# EAGLE design Intan Headstage (EAGLE 9.6.2)
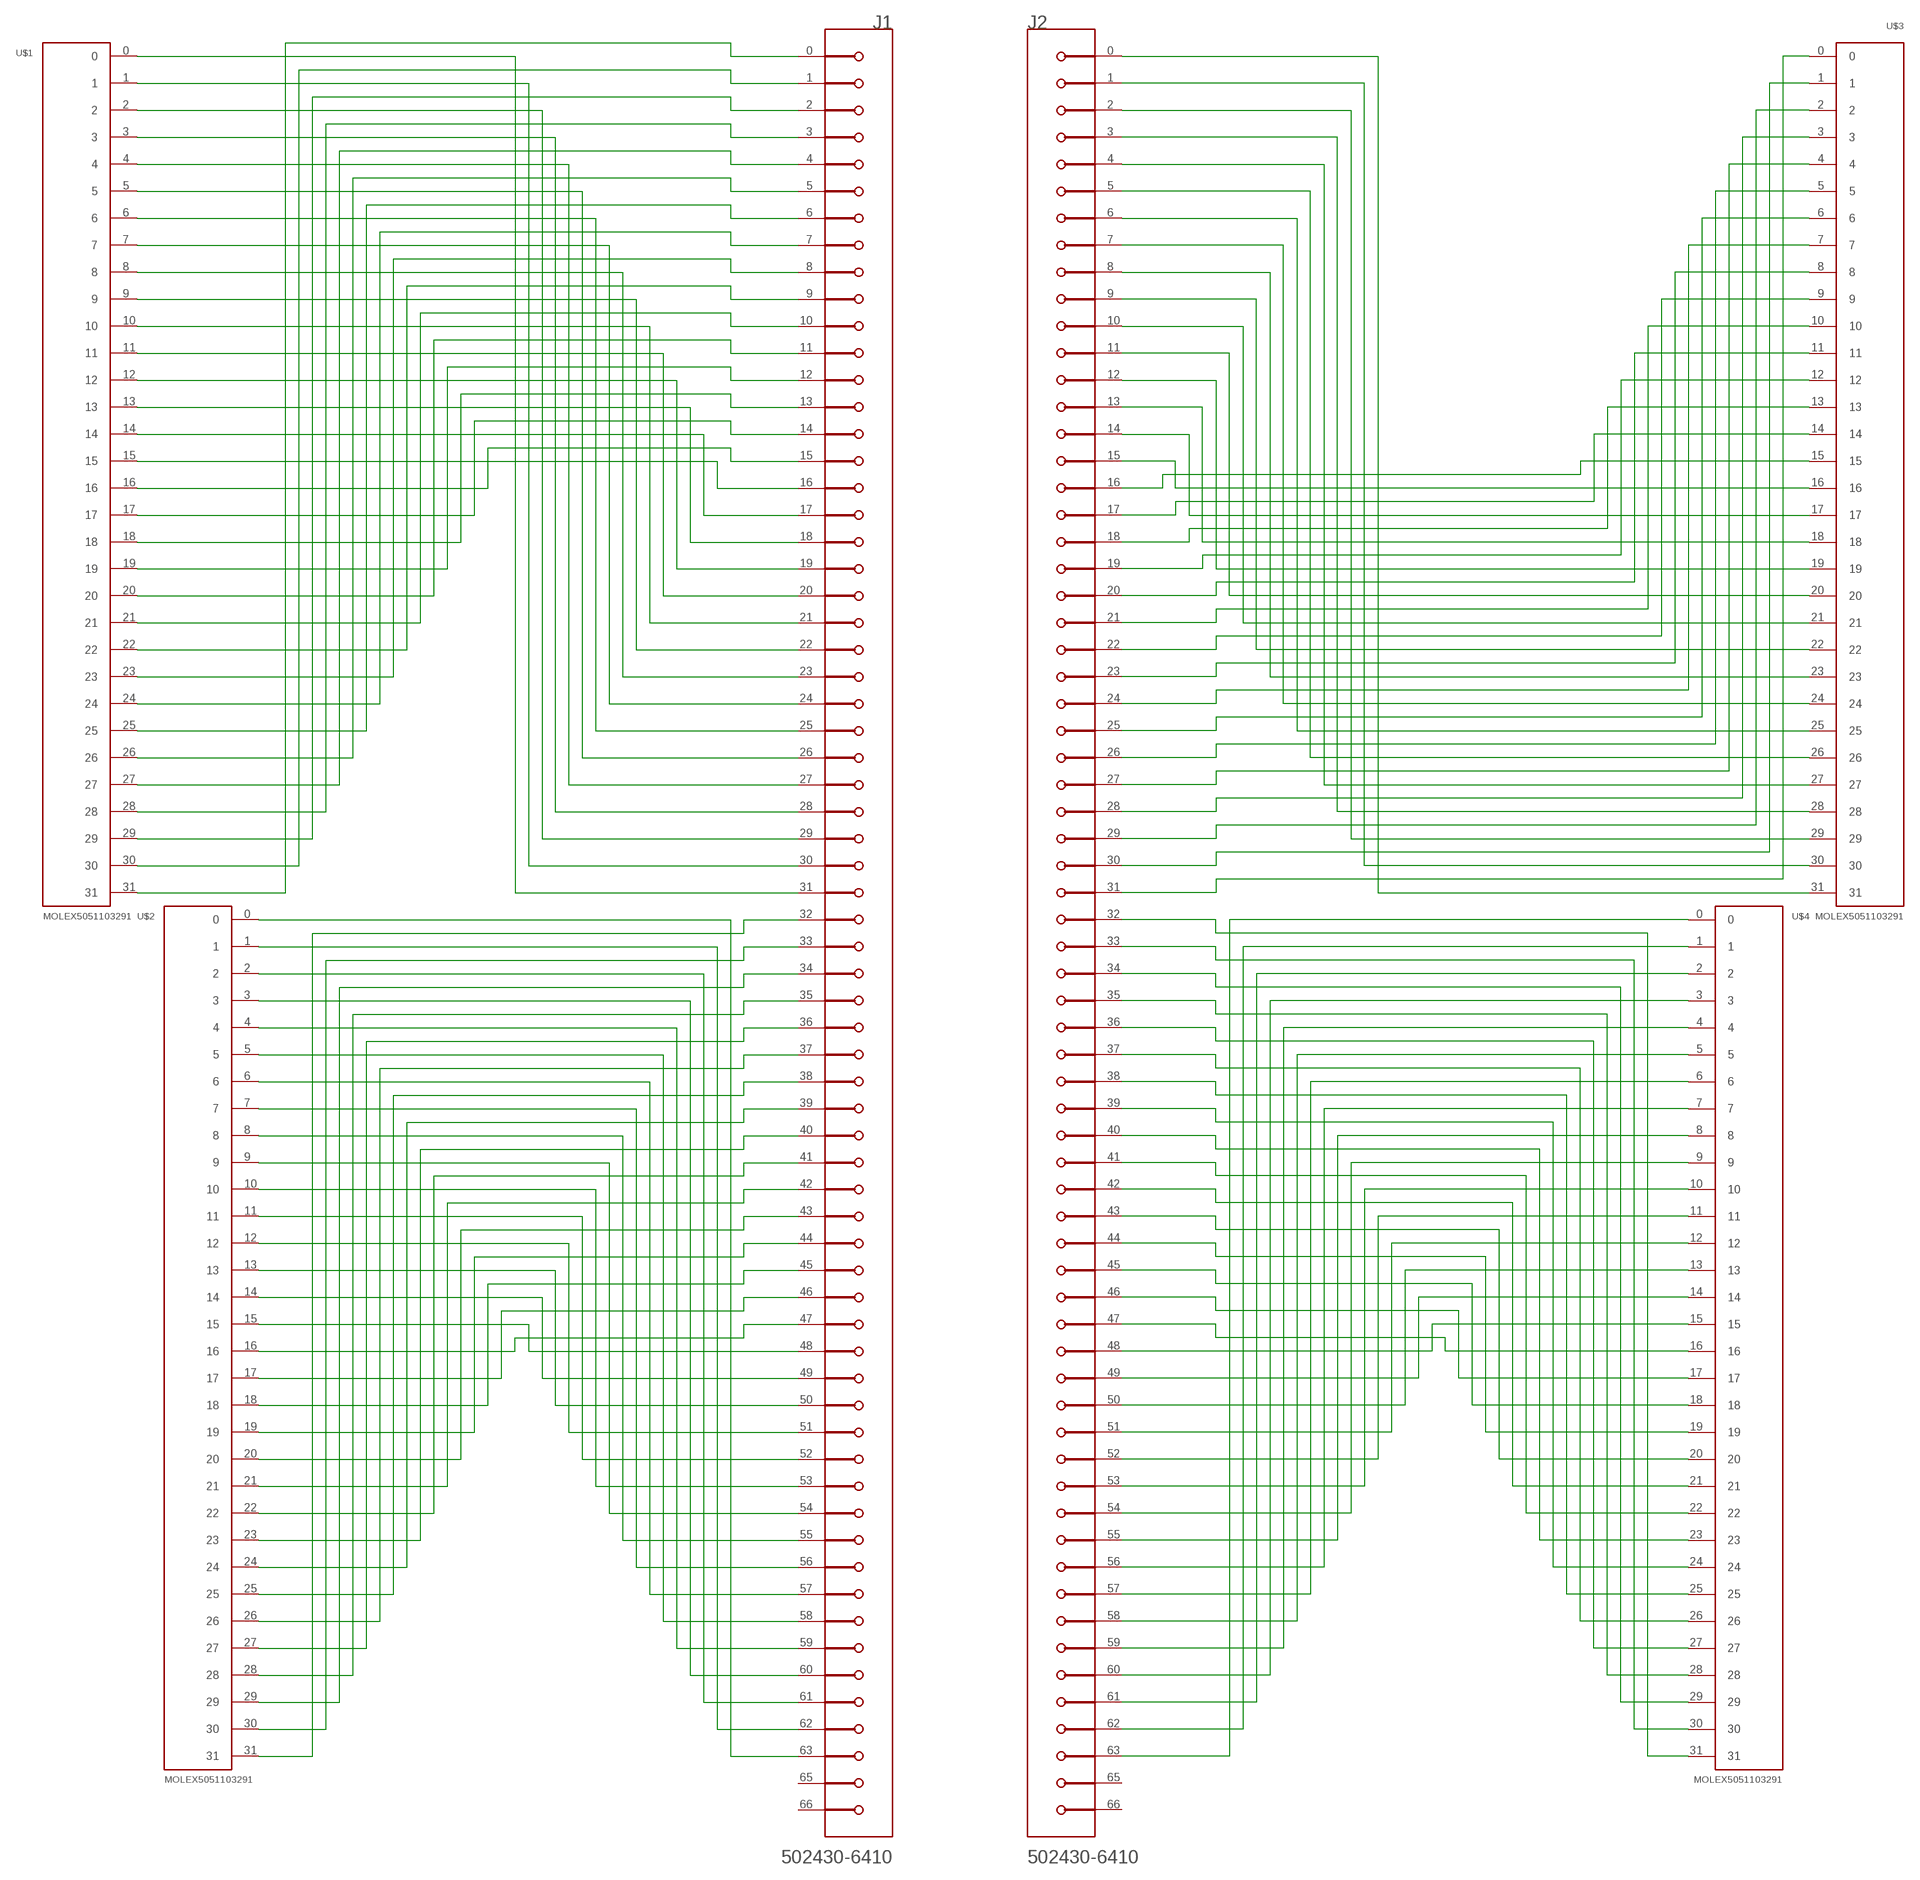
[diagram p0: schematic, sheet 1]

## Parts
J1  MOLEX_502430-6410MOLEX_502430-6410_0_0  [MOLEX_502430-6410_0]
J2  MOLEX_502430-6410MOLEX_502430-6410_0_0  [MOLEX_502430-6410_0]
U$1  MOLEX5051103291  [MOLEX5051103291]
U$2  MOLEX5051103291  [MOLEX5051103291]
U$3  MOLEX5051103291  [MOLEX5051103291]
U$4  MOLEX5051103291  [MOLEX5051103291]

## Nets
N$1: J1.31 U$1.0
N$2: J1.30 U$1.1
N$3: J1.29 U$1.2
N$4: J1.28 U$1.3
N$5: J1.27 U$1.4
N$6: J1.26 U$1.5
N$7: J1.25 U$1.6
N$8: J1.24 U$1.7
N$9: J1.23 U$1.8
N$10: J1.22 U$1.9
N$11: J1.21 U$1.10
N$12: J1.20 U$1.11
N$13: J1.19 U$1.12
N$14: J1.18 U$1.13
N$15: J1.17 U$1.14
N$16: J1.16 U$1.15
N$17: J1.15 U$1.16
N$18: J1.14 U$1.17
N$19: J1.13 U$1.18
N$20: J1.12 U$1.19
N$21: J1.11 U$1.20
N$22: J1.10 U$1.21
N$23: J1.9 U$1.22
N$24: J1.8 U$1.23
N$25: J1.7 U$1.24
N$26: J1.6 U$1.25
N$27: J1.5 U$1.26
N$28: J1.4 U$1.27
N$29: J1.3 U$1.28
N$30: J1.2 U$1.29
N$31: J1.1 U$1.30
N$32: J1.0 U$1.31
N$33: J2.0 U$3.31
N$34: J2.1 U$3.30
N$35: J2.2 U$3.29
N$36: J2.3 U$3.28
N$37: J2.4 U$3.27
N$38: J2.5 U$3.26
N$39: J2.6 U$3.25
N$40: J2.7 U$3.24
N$41: J2.8 U$3.23
N$42: J2.9 U$3.22
N$43: J2.10 U$3.21
N$44: J2.11 U$3.20
N$45: J2.12 U$3.19
N$46: J2.13 U$3.18
N$47: J2.14 U$3.17
N$48: J2.15 U$3.16
N$49: J2.31 U$3.0
N$50: J2.30 U$3.1
N$51: J2.29 U$3.2
N$52: J2.28 U$3.3
N$53: J2.27 U$3.4
N$54: J2.26 U$3.5
N$55: J2.25 U$3.6
N$56: J2.24 U$3.7
N$57: J2.23 U$3.8
N$58: J2.22 U$3.9
N$59: J2.21 U$3.10
N$60: J2.20 U$3.11
N$61: J2.19 U$3.12
N$62: J2.18 U$3.13
N$63: J2.17 U$3.14
N$64: J2.16 U$3.15
N$65: J1.63 U$2.0
N$66: J1.62 U$2.1
N$67: J1.61 U$2.2
N$68: J1.60 U$2.3
N$69: J1.59 U$2.4
N$70: J1.58 U$2.5
N$71: J1.57 U$2.6
N$72: J1.56 U$2.7
N$73: J1.55 U$2.8
N$74: J1.54 U$2.9
N$75: J1.53 U$2.10
N$76: J1.52 U$2.11
N$77: J1.51 U$2.12
N$78: J1.50 U$2.13
N$79: J1.49 U$2.14
N$80: J1.48 U$2.15
N$81: J1.47 U$2.16
N$82: J1.46 U$2.17
N$83: J1.45 U$2.18
N$84: J1.44 U$2.19
N$85: J1.43 U$2.20
N$86: J1.42 U$2.21
N$87: J1.41 U$2.22
N$88: J1.40 U$2.23
N$89: J1.39 U$2.24
N$90: J1.38 U$2.25
N$91: J1.37 U$2.26
N$92: J1.36 U$2.27
N$93: J1.35 U$2.28
N$94: J1.34 U$2.29
N$95: J1.33 U$2.30
N$96: J1.32 U$2.31
N$97: J2.32 U$4.31
N$98: J2.33 U$4.30
N$99: J2.34 U$4.29
N$100: J2.35 U$4.28
N$101: J2.36 U$4.27
N$102: J2.37 U$4.26
N$103: J2.38 U$4.25
N$104: J2.39 U$4.24
N$105: J2.40 U$4.23
N$106: J2.41 U$4.22
N$107: J2.42 U$4.21
N$108: J2.43 U$4.20
N$109: J2.44 U$4.19
N$110: J2.45 U$4.18
N$111: J2.46 U$4.17
N$112: J2.47 U$4.16
N$113: J2.48 U$4.15
N$114: J2.49 U$4.14
N$115: J2.50 U$4.13
N$116: J2.51 U$4.12
N$117: J2.52 U$4.11
N$118: J2.53 U$4.10
N$119: J2.54 U$4.9
N$120: J2.55 U$4.8
N$121: J2.56 U$4.7
N$122: J2.57 U$4.6
N$123: J2.58 U$4.5
N$124: J2.59 U$4.4
N$125: J2.60 U$4.3
N$126: J2.61 U$4.2
N$127: J2.62 U$4.1
N$128: J2.63 U$4.0
Unconnected: J1.65(MNT_1) J1.66(MNT_2) J2.65(MNT_1) J2.66(MNT_2)

## Library data of the parts
J1 J2 = Molex Slimstack:MOLEX_502430-6410: 64 Position Connector Plug, Outer Shroud Contacts Surface Mount Gold; CENTROID_NOT_SPECIFIED: No; DATASHEET: http://www.molex.com/pdm_docs/sd/5024306410_sd.pdf; DIGIKEY_DESCRIPTION: CONN PLUG 64POS VERT DUAL SMD; DIGIKEY_PART_NUMBER: WM24084TR-ND; IS_FEMALE: yes; LEAD_FREE: yes; MF: Molex; MOUSER_PART_NUMBER: 538-502430-6410; MPN: 502430-6410; PACKAGE: CONN_SMD; PREFIX: J; ROHS: yes; TEMPERATURE_RANGE_HIGH: +85°C; TEMPERATURE_RANGE_LOW: -20°C; VOLTAGE: 50V
U$1-U$4 = ZIF Connector:MOLEX5051103291

## Board
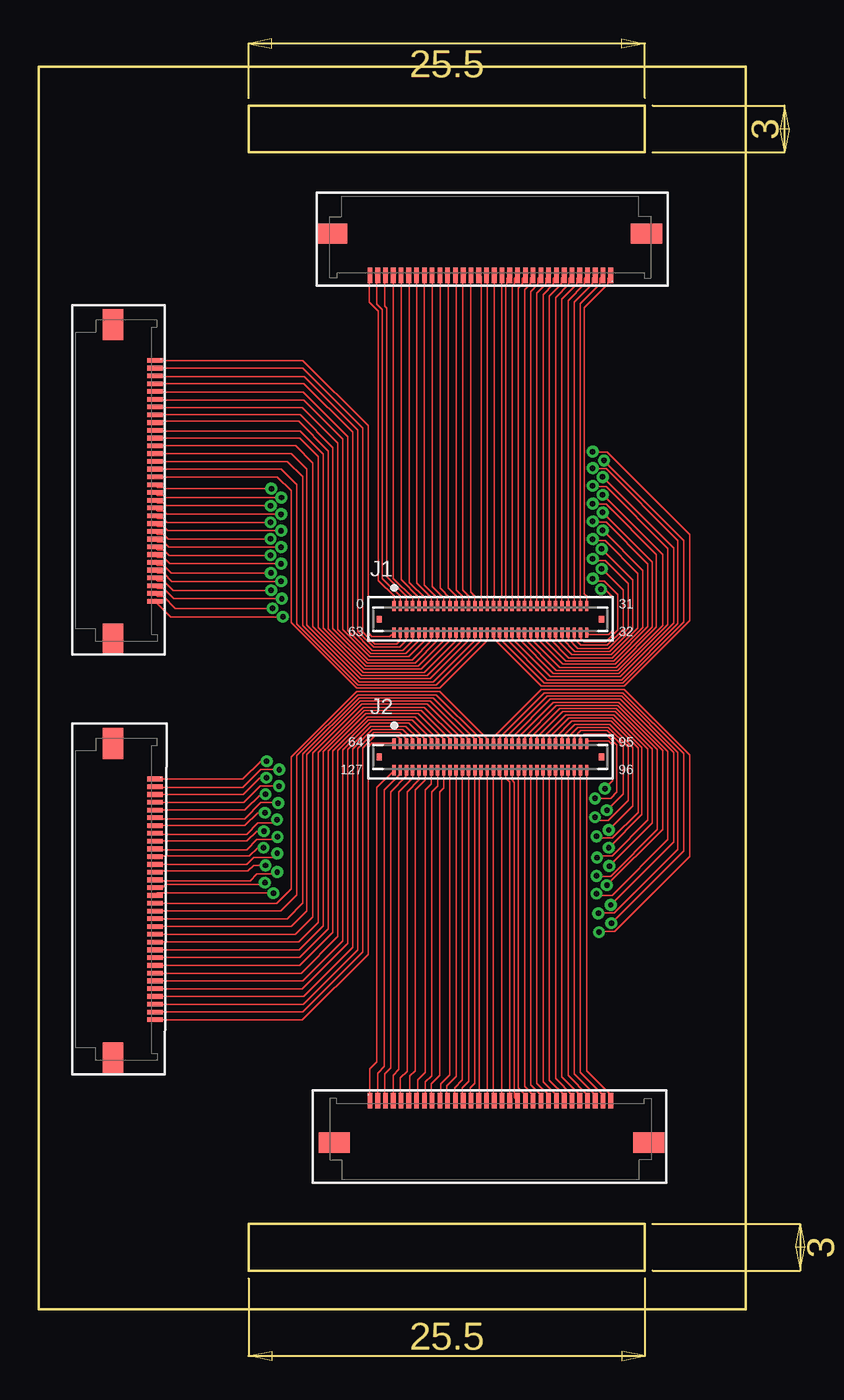
[diagram p1: board, top side]
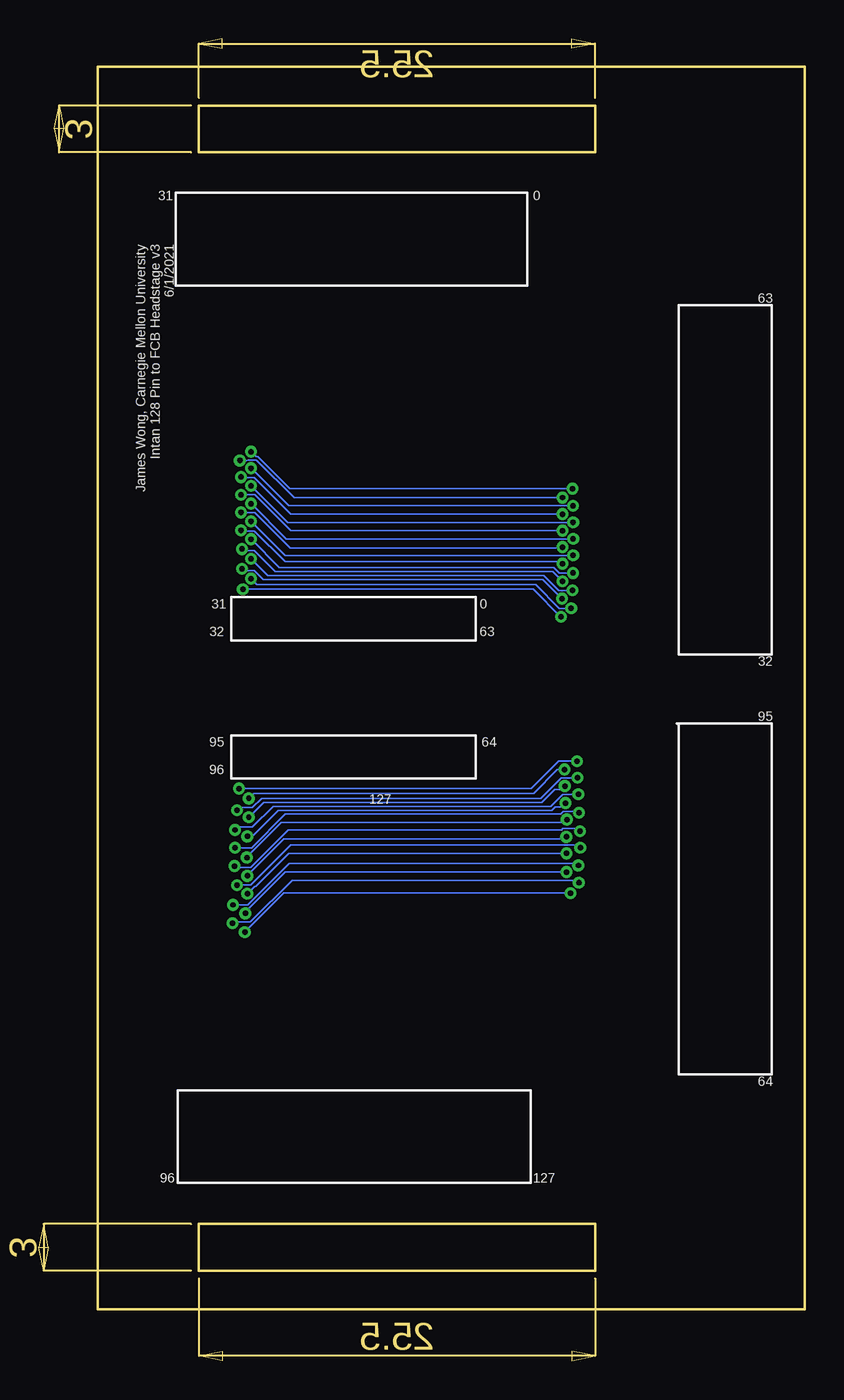
[diagram p2: board, bottom side, seen from below]

Size 45.5 x 80 mm. Coordinates in mm from the lower left corner, seen from the top.
Outline: 13.5,2.5 39,2.5 39,5.5 13.5,5.5 13.5,2.5
Outline: 39,77.5 13.5,77.5 13.5,74.5 39,74.5 39,77.5
Outline: 0,0 0,80 45.5,80 45.5,0 0,0
Copper layers (1*16): Top 0.035mm / dielectric 1.5mm / Bottom 0.035mm
Design rules "default *": minimum track width 4mil, minimum drill 0.35mm, track to track 4mil, track to pad 4mil, pad to pad 4mil, via to via 4mil, smd to smd 4mil, copper to edge 40mil, drill to drill 6mil, minimum pad ring 10mil, minimum via ring 8mil, stop-mask expansion 4mil, vias tented up to drill 0mil, thermal gap 10mil

### Footprints (pad centres in the part's own frame; a part is rotated, then mirrored left to right if it is on the bottom)
MOLEX_502430-6410_0 = smd 0.22 x 0.66: 0 -6.2,0.855; 1 -5.8,0.855; 2 -5.4,0.855; 3 -5,0.855; 4 -4.6,0.855; 5 -4.2,0.855; 6 -3.8,0.855; 7 -3.4,0.855; 8 -3,0.855; 9 -2.6,0.855; 10 -2.2,0.855; 11 -1.8,0.855; 12 -1.4,0.855; 13 -1,0.855; 14 -0.6,0.855; 15 -0.2,0.855; 16 0.2,0.855; 17 0.6,0.855; 18 1,0.855; 19 1.4,0.855; 20 1.8,0.855; 21 2.2,0.855; 22 2.6,0.855; 23 3,0.855; 24 3.4,0.855; 25 3.8,0.855; 26 4.2,0.855; 27 4.6,0.855; 28 5,0.855; 29 5.4,0.855; 30 5.8,0.855; 31 6.2,0.855; 32 6.2,-0.855; 33 5.8,-0.855; 34 5.4,-0.855; 35 5,-0.855; 36 4.6,-0.855; 37 4.2,-0.855; 38 3.8,-0.855; 39 3.4,-0.855; 40 3,-0.855; 41 2.6,-0.855; 42 2.2,-0.855; 43 1.8,-0.855; 44 1.4,-0.855; 45 1,-0.855; 46 0.6,-0.855; 47 0.2,-0.855; 48 -0.2,-0.855; 49 -0.6,-0.855; 50 -1,-0.855; 51 -1.4,-0.855; 52 -1.8,-0.855; 53 -2.2,-0.855; 54 -2.6,-0.855; 55 -3,-0.855; 56 -3.4,-0.855; 57 -3.8,-0.855; 58 -4.2,-0.855; 59 -4.6,-0.855; 60 -5,-0.855; 61 -5.4,-0.855; 62 -5.8,-0.855; 63 -6.2,-0.855 | smd 0.35 x 0.44: 65 -7.15,0; 66 7.15,0
MOLEX5051103291 = smd 0.3 x 1: 0 -7.75,0; 1 -7.25,0; 2 -6.75,0; 3 -6.25,0; 4 -5.75,0; 5 -5.25,0; 6 -4.75,0; 7 -4.25,0; 8 -3.75,0; 9 -3.25,0; 10 -2.75,0; 11 -2.25,0; 12 -1.75,0; 13 -1.25,0; 14 -0.75,0; 15 -0.25,0; 16 0.25,0; 17 0.75,0; 18 1.25,0; 19 1.75,0; 20 2.25,0; 21 2.75,0; 22 3.25,0; 23 3.75,0; 24 4.25,0; 25 4.75,0; 26 5.25,0; 27 5.75,0; 28 6.25,0; 29 6.75,0; 30 7.25,0; 31 7.75,0 | smd 2 x 1.3: Z1 -10.05,-2.7; Z2 10.2,-2.7

### Placement (x,y rotation side)
J1  29.06,44.43 0 top
J2  29.06,35.57 0 top
U$1  29.06,66.56 180 top
U$2  7.47,53.35 270 top
U$3  7.47,26.4 270 top
U$4  29.06,13.44 0 top

### Tracks (layer width: path | path; a pad name or v marks a point on that pad's centre or on a via)
N$1
  Top 0.102: J1.31 35.26,45.92 35.11,46.07 35.11,64.49 36.61,65.99 36.61,66.36 U$1.0
N$2
  Top 0.102: U$1.1 36.11,66.36 36.11,65.99 34.86,64.74 J1.30
N$3
  Top 0.102: U$1.2 35.61,66.36 35.61,65.99 34.46,64.84 J1.29
N$4
  Top 0.102: U$1.3 35.11,66.36 35.11,65.99 34.06,64.94 J1.28
N$5
  Top 0.102: U$1.4 34.61,66.36 34.61,65.99 33.66,65.04 J1.27
N$6
  Top 0.102: U$1.5 34.11,66.36 34.11,65.99 33.26,65.14 J1.26
N$7
  Top 0.102: U$1.6 33.61,66.36 33.61,65.99 32.86,65.24 J1.25
N$8
  Top 0.102: U$1.7 33.11,66.36 33.11,65.99 32.46,65.34 J1.24
N$9
  Top 0.102: U$1.8 32.61,66.36 32.61,65.99 32.06,65.44 J1.23
N$10
  Top 0.102: U$1.9 32.11,66.36 32.11,65.99 31.66,65.54 J1.22
N$11
  Top 0.102: U$1.10 31.61,66.36 31.61,65.99 31.26,65.64 J1.21
N$12
  Top 0.102: U$1.11 31.11,66.36 31.11,65.99 30.86,65.74 J1.20
N$13
  Top 0.102: U$1.12 30.61,66.36 30.61,65.99 30.46,65.84 J1.19
N$14
  Top 0.102: J1.18 30.06,65.94 30.11,65.99 30.11,66.36 U$1.13
N$15
  Top 0.102: J1.17 29.66,45.8 29.79,45.92 29.79,66.41 29.81,66.43 U$1.14
N$16
  Top 0.102: U$1.15 29.31,45.88 29.26,45.83 J1.16
N$17
  Top 0.102: J1.15 28.86,66.38 28.81,66.43 U$1.16
N$18
  Top 0.102: J1.14 28.46,66.53 28.31,66.38 U$1.17
N$19
  Top 0.102: J1.13 28.06,45.92 27.8,46.18 U$1.18
N$20
  Top 0.102: U$1.19 27.28,66.52 27.28,46.3 27.66,45.92 J1.12
N$21
  Top 0.102: U$1.20 26.88,66.49 26.88,46.3 27.26,45.92 J1.11
N$22
  Top 0.102: U$1.21 26.31,66.34 26.35,66.39 26.35,46.43 26.86,45.92 J1.10
N$23
  Top 0.102: U$1.22 25.82,66.54 25.82,46.43 26.46,45.8 J1.9
N$24
  Top 0.102: J1.8 26.05,45.3 26.05,45.81 25.31,46.55 U$1.23
N$25
  Top 0.102: J1.7 25.65,45.3 25.65,45.81 24.81,46.65 U$1.24
N$26
  Top 0.102: J1.6 25.25,45.3 25.25,45.82 24.31,46.76 U$1.25
N$27
  Top 0.102: U$1.26 23.84,66.52 23.84,46.81 24.86,45.8 J1.5
N$28
  Top 0.102: J1.4 24.45,45.3 24.45,45.83 23.31,46.97 U$1.27
N$29
  Top 0.102: J1.3 24.05,45.3 24.05,45.82 22.81,47.06 U$1.28
N$30
  Top 0.102: U$1.29 22.25,66.5 22.25,64.59 22.39,64.46 22.39,47.19 23.66,45.92 J1.2
N$31
  Top 0.102: U$1.30 21.75,66.5 21.75,64.72 22.12,64.36 22.12,47.06 23.26,45.92 J1.1
N$32
  Top 0.102: U$1.31 21.25,66.5 21.25,64.85 21.84,64.26 21.84,46.94 22.86,45.92 J1.0
N$33
  Top 0.102: U$3.31 16.97,18.65 21.18,22.87 21.18,36.2 21.44,36.46 22.82,36.46 J2.0 22.85,36.46
N$34
  Top 0.102: U$3.30 16.97,19.15 20.84,23.02 20.84,36.15 21.62,36.93 23.03,36.93 23.25,36.71 23.25,36.43 J2.1
N$35
  Top 0.102: U$3.29 17.02,19.65 20.52,23.15 20.52,36.11 21.54,37.13 23.23,37.13 23.65,36.71 23.65,36.43 J2.2
N$36
  Top 0.102: U$3.28 17.04,20.15 20.19,23.3 20.19,36.07 21.46,37.34 23.43,37.34 24.05,36.71 24.05,36.43 J2.3
N$37
  Top 0.102: U$3.27 16.96,20.65 19.89,23.58 19.89,36.05 21.37,37.54 23.62,37.54 24.45,36.71 24.45,36.43 J2.4
N$38
  Top 0.102: U$3.26 16.97,21.15 19.55,23.73 19.55,36.01 21.29,37.74 23.82,37.74 24.85,36.71 24.85,36.43 J2.5
N$39
  Top 0.102: U$3.25 16.89,21.65 19.25,24 19.25,35.99 21.2,37.95 24.02,37.95 25.25,36.71 25.25,36.43 J2.6
N$40
  Top 0.102: U$3.24 16.79,22.15 18.92,24.28 18.92,35.95 21.12,38.15 24.21,38.15 25.65,36.71 25.65,36.43 J2.7
N$41
  Top 0.102: U$3.23 16.79,22.65 18.64,24.5 18.64,35.96 21.04,38.35 24.41,38.35 26.05,36.71 26.05,36.43 J2.8
N$42
  Top 0.102: U$3.22 16.77,23.15 18.31,24.69 18.31,35.91 20.95,38.55 24.61,38.55 26.45,36.71 26.45,36.43 J2.9
N$43
  Top 0.102: U$3.21 16.73,23.65 17.98,24.9 17.98,35.87 20.87,38.76 24.8,38.76 26.85,36.71 26.85,36.43 J2.10
N$44
  Top 0.102: U$3.20 16.5,24.15 17.63,25.28 17.63,35.81 20.78,38.96 25,38.96 27.25,36.71 27.25,36.43 J2.11
N$45
  Top 0.102: U$3.19 16.23,24.65 17.25,25.66 17.25,35.71 20.7,39.16 25.2,39.16 27.65,36.71 27.65,36.43 J2.12
N$46
  Top 0.102: U$3.18 15.97,25.15 16.99,26.16 16.99,35.74 20.61,39.37 25.39,39.37 28.05,36.71 28.05,36.43 J2.13
N$47
  Top 0.102: U$3.17 15.58,25.65 16.61,26.68 16.61,35.65 20.53,39.57 25.59,39.57 28.45,36.71 28.45,36.43 J2.14
N$48
  Top 0.102: U$3.16 15.32,26.15 16.23,27.06 16.23,35.56 20.45,39.77 25.79,39.77 28.85,36.71 28.85,36.43 J2.15
N$49  (via drill 0.35)
  Top 0.102: v36.42,33.53 36.93,34.04 36.93,36.33 36.68,36.58 35.4,36.58 35.26,36.45 J2.31 | v14.66,35.29 14.27,35.29 13.13,34.15 U$3.0
  Bottom 0.102: v36.42,33.53 17.61,33.53 15.83,35.31 14.68,35.31 v14.66,35.29
N$50  (via drill 0.35)
  Top 0.102: U$3.1 7.53,33.59 13.11,33.59 14.28,34.76 v15.47,34.76 | J2.30 34.86,36.83 35.09,37.06 36.49,37.06 37.2,36.35 37.2,33.31 36.79,32.9 v35.79,32.9
  Bottom 0.102: v15.47,34.76 15.93,34.76 17.46,33.23 35.46,33.23 v35.79,32.9
N$51  (via drill 0.35)
  Top 0.102: v36.55,32.14 37.6,33.18 37.6,36.24 36.58,37.26 34.89,37.26 34.46,36.83 J2.29 | v14.64,34.22 14.22,34.22 13.15,33.15 U$3.2
  Bottom 0.102: v36.55,32.14 36.37,32.32 35.55,32.32 34.97,32.9 16.99,32.9 15.67,34.22 v14.64,34.22
N$52  (via drill 0.35)
  Top 0.102: v35.79,31.69 36,31.48 36.65,31.48 37.93,32.77 37.93,36.19 36.66,37.46 34.69,37.46 34.07,36.84 34.07,36.71 34.06,36.7 J2.28 | v15.45,33.69 14.23,33.69 13.19,32.65 U$3.3
  Bottom 0.102: v15.45,33.69 15.67,33.48 16.09,33.48 16.92,32.65 34.83,32.65 v35.79,31.69
N$53  (via drill 0.35)
  Top 0.102: v36.68,30.87 38.23,32.42 38.23,36.18 36.74,37.67 34.49,37.67 33.66,36.83 J2.27 | v14.58,33.16 14.27,33.16 13.25,32.15 U$3.4
  Bottom 0.102: v36.68,30.87 36.5,31.05 35.55,31.05 34.21,32.39 16.36,32.39 15.59,33.16 v14.58,33.16
N$54  (via drill 0.35)
  Top 0.102: v35.88,30.45 36,30.34 36.9,30.34 38.57,32 38.57,36.13 36.83,37.87 34.3,37.87 33.26,36.83 J2.26 | v15.4,32.6 15.37,32.63 14.28,32.63 13.24,31.59 7.53,31.59 U$3.5
  Bottom 0.102: v15.4,32.6 15.64,32.36 16.07,32.36 16.29,32.14 33.88,32.14 35.57,30.45 v35.88,30.45
N$55  (via drill 0.35)
  Top 0.102: v36.68,29.73 38.81,31.86 38.81,36.17 36.91,38.07 34.1,38.07 32.86,36.83 J2.25 | v14.54,31.97 14.08,31.97 13.25,31.15 U$3.6
  Bottom 0.102: v36.68,29.73 35.6,29.73 33.45,31.88 15.72,31.88 15.54,32.07 14.64,32.07 v14.54,31.97
N$56  (via drill 0.35)
  Top 0.102: v35.92,29.09 36.02,29.19 36.9,29.19 39.2,31.5 39.2,36.07 37,38.28 33.91,38.28 32.46,36.83 J2.24 | v15.32,31.54 15.1,31.32 14.09,31.32 13.37,30.59 7.53,30.59 U$3.7
  Bottom 0.102: v35.92,29.09 35.92,29.12 33.69,31.35 15.47,31.35 15.32,31.5 v15.32,31.54
N$57  (via drill 0.35)
  Top 0.102: v36.71,28.55 39.48,31.31 39.48,36.08 37.08,38.48 33.71,38.48 32.06,36.83 J2.23 | v14.48,30.79 14.02,30.79 13.38,30.15 U$3.8
  Bottom 0.102: v36.71,28.55 36.63,28.47 35.65,28.47 33.25,30.87 15.66,30.87 15.57,30.95 14.64,30.95 v14.48,30.79
N$58  (via drill 0.35)
  Top 0.102: v35.88,27.91 35.9,27.89 36.81,27.89 39.81,30.89 39.81,36.04 37.17,38.68 33.51,38.68 31.66,36.83 J2.22 | v15.35,30.42 15.19,30.26 14.03,30.26 13.37,29.59 7.53,29.59 U$3.9
  Bottom 0.102: v15.35,30.42 15.42,30.42 15.55,30.29 33.54,30.29 35.86,27.97 35.86,27.93 v35.88,27.91
N$59  (via drill 0.35)
  Top 0.102: v36.55,27.31 40.14,30.9 40.14,36 37.25,38.89 33.31,38.89 31.26,36.83 J2.21 | v14.45,29.73 14.07,29.73 13.54,29.19 7.68,29.19 7.64,29.15 U$3.10
  Bottom 0.102: v36.55,27.31 35.66,27.31 33.09,29.89 14.67,29.89 14.62,29.89 v14.45,29.73
N$60  (via drill 0.35)
  Top 0.102: v35.88,26.77 36,26.65 36.9,26.65 40.49,30.25 40.49,35.93 37.33,39.09 33.12,39.09 30.87,36.84 30.87,36.71 30.86,36.7 J2.20 | U$3.11 13.38,28.65 13.85,29.11 15.1,29.11 v15.34,29.36
  Bottom 0.102: v35.88,26.77 35.41,27.24 35.33,27.24 33.2,29.36 v15.34,29.36
N$61  (via drill 0.35)
  Top 0.102: v36.81,26.04 40.87,30.11 40.87,35.84 37.42,39.29 32.92,39.29 30.46,36.83 J2.19 | U$3.12 7.54,28.22 13.46,28.22 13.82,28.58 v14.58,28.58
  Bottom 0.102: v36.81,26.04 35.86,26.04 33.2,28.7 14.7,28.7 v14.58,28.58
N$62  (via drill 0.35)
  Top 0.102: v36.01,25.5 36.02,25.51 37.03,25.51 41.13,29.61 41.13,35.87 37.5,39.49 32.72,39.49 30.06,36.83 J2.18 | U$3.13 7.53,27.59 13.59,27.59 14.03,28.04 15.22,28.04 v15.34,28.16
  Bottom 0.102: v36.01,25.5 36.01,25.6 33.45,28.16 v15.34,28.16
N$63  (via drill 0.35)
  Top 0.102: v36.84,24.86 41.51,29.53 41.51,35.78 37.59,39.7 32.53,39.7 29.66,36.83 J2.17 | U$3.14 7.53,27.09 7.91,27.09 8.16,27.35 14.42,27.35 v14.55,27.47
  Bottom 0.102: v36.84,24.86 36.59,24.86 36.5,24.95 35.68,24.95 33,27.63 14.7,27.63 v14.55,27.47
N$64  (via drill 0.35)
  Top 0.102: v36.04,24.29 36.08,24.33 37.06,24.33 41.89,29.16 41.89,35.69 37.67,39.9 32.33,39.9 29.26,36.83 J2.16 | v15.09,26.8 7.62,26.8 U$3.15
  Bottom 0.102: v15.09,26.8 33.54,26.8 36.04,24.3 v36.04,24.29
N$65
  Top 0.102: J1.63 22.6,43.31 21.44,43.31 21.18,43.57 21.18,56.9 16.99,61.1 U$2.0
N$66
  Top 0.102: J1.62 23.25,43.57 23.25,43.06 23.03,42.84 21.62,42.84 20.84,43.62 20.84,56.75 17,60.6 U$2.1
N$67
  Top 0.102: U$2.2 7.51,60.05 17.09,60.05 20.52,56.62 20.52,43.66 21.54,42.64 23.23,42.64 23.65,43.06 23.65,43.57 J1.61
N$68
  Top 0.102: J1.60 24.05,43.57 24.05,43.06 23.43,42.43 21.46,42.43 20.19,43.7 20.19,56.47 17.06,59.6 U$2.3
N$69
  Top 0.102: U$2.4 7.6,59.1 7.64,59.05 17.03,59.05 19.89,56.19 19.89,43.72 21.37,42.23 23.62,42.23 24.45,43.06 24.45,43.57 J1.59
N$70
  Top 0.102: U$2.5 7.51,58.55 17.04,58.55 19.55,56.04 19.55,43.76 21.29,42.03 23.82,42.03 24.85,43.06 24.85,43.57 J1.58
N$71
  Top 0.102: U$2.6 7.51,58.05 16.97,58.05 19.25,55.77 19.25,43.78 21.2,41.82 24.02,41.82 25.25,43.06 25.25,43.57 J1.57
N$72
  Top 0.102: J1.56 25.65,43.57 25.65,43.06 24.21,41.62 21.12,41.62 18.92,43.82 18.92,55.49 16.81,57.6 U$2.7
N$73
  Top 0.102: U$2.8 7.55,57.18 16.73,57.18 18.64,55.27 18.64,43.81 21.04,41.42 24.41,41.42 26.05,43.06 26.05,43.57 J1.55
N$74
  Top 0.102: U$2.9 7.51,56.55 16.84,56.55 18.31,55.08 18.31,43.86 20.95,41.22 24.61,41.22 26.45,43.06 26.45,43.57 J1.54
N$75
  Top 0.102: J1.53 26.85,43.57 26.85,43.06 24.8,41.01 20.87,41.01 17.98,43.9 17.98,54.91 16.8,56.1 U$2.10
N$76
  Top 0.102: J1.52 27.25,43.57 27.25,43.06 25,40.81 20.78,40.81 17.63,43.96 17.63,54.49 16.52,55.6 U$2.11
N$77
  Top 0.102: J1.51 27.65,43.57 27.65,43.06 25.2,40.6 20.7,40.6 17.25,44.06 17.25,54.11 16.26,55.1 U$2.12
N$78
  Top 0.102: 7.61,54.6 U$2.13 16,54.6 16.99,53.6 16.99,44.03 20.61,40.4 25.39,40.4 28.05,43.06 28.05,43.57 J1.50
N$79
  Top 0.102: J1.49 28.45,43.57 28.45,43.06 25.59,40.2 20.53,40.2 16.61,44.12 16.61,53.09 15.61,54.1 U$2.14
N$80
  Top 0.102: J1.48 28.86,43.07 25.79,39.99 20.45,39.99 16.23,44.21 16.23,52.71 15.35,53.6 U$2.15
N$81  (via drill 0.35)
  Top 0.102: J1.47 29.27,43.57 29.27,43.18 32.33,40.12 37.67,40.12 41.89,44.34 41.89,49.88 36.59,55.18 35.69,55.18 v35.64,55.22 | v14.96,52.84 8.09,52.84 8.03,52.9 7.67,52.9 U$2.16
  Bottom 0.102: v35.64,55.22 35.32,54.9 35.22,54.9 33.16,52.84 v14.96,52.84
N$82  (via drill 0.35)
  Top 0.102: v36.37,54.65 41.51,49.51 41.51,44.24 37.59,40.33 32.53,40.33 29.67,43.18 29.67,43.57 J1.46 | U$2.17 7.67,52.4 8.03,52.4 8.16,52.27 v15.61,52.27
  Bottom 0.102: v36.37,54.65 35.91,54.65 35.86,54.69 35.3,54.69 32.88,52.27 v15.61,52.27
N$83  (via drill 0.35)
  Top 0.102: v35.64,54.16 35.69,54.12 36.51,54.12 41.13,49.5 41.13,44.15 37.5,40.53 32.72,40.53 30.07,43.18 30.07,43.44 30.06,43.45 J1.45 | U$2.18 7.67,51.9 8.03,51.9 8.2,51.74 v14.92,51.74
  Bottom 0.102: v35.64,54.16 33.22,51.74 v14.92,51.74
N$84  (via drill 0.35)
  Top 0.102: J1.44 30.47,43.57 30.47,43.18 32.92,40.73 37.42,40.73 40.87,44.18 40.87,49.01 v36.29,53.59 | U$2.19 7.67,51.4 8.03,51.4 8.23,51.2 v15.6,51.2
  Bottom 0.102: v36.29,53.59 36.24,53.55 35.42,53.55 33.07,51.2 v15.6,51.2
N$85  (via drill 0.35)
  Top 0.102: J1.43 30.87,43.57 30.87,43.18 33.12,40.94 37.33,40.94 40.49,44.09 40.49,48.99 36.51,52.98 35.69,52.98 v35.64,53.02 | U$2.20 7.67,50.9 8.03,50.9 8.27,50.67 v14.91,50.67
  Bottom 0.102: v35.64,53.02 33.29,50.67 v14.91,50.67
N$86  (via drill 0.35)
  Top 0.102: J1.42 31.27,43.57 31.27,43.18 33.31,41.14 37.25,41.14 40.14,44.03 40.14,48.59 v36.29,52.45 | U$2.21 7.67,50.4 8.03,50.4 8.3,50.13 v15.6,50.13
  Bottom 0.102: v36.29,52.45 35.4,52.45 33.09,50.13 v15.6,50.13
N$87  (via drill 0.35)
  Top 0.102: J1.41 31.67,43.57 31.67,43.18 33.51,41.34 37.17,41.34 39.75,43.93 39.75,48.59 36.51,51.83 35.69,51.83 v35.64,51.88 | U$2.22 7.67,49.9 8.03,49.9 8.33,49.6 v14.91,49.6
  Bottom 0.102: v35.64,51.88 33.37,49.6 v14.91,49.6
N$88  (via drill 0.35)
  Top 0.102: J1.40 32.07,43.57 32.07,43.18 33.71,41.55 37.08,41.55 39.48,43.94 39.48,48.11 v36.29,51.3 | U$2.23 7.67,49.4 8.03,49.4 8.36,49.07 v15.6,49.07
  Bottom 0.102: v36.29,51.3 35.4,51.3 33.12,49.03 15.64,49.03 v15.6,49.07
N$89  (via drill 0.35)
  Top 0.102: J1.39 32.47,43.57 32.47,43.18 33.91,41.75 37,41.75 39.2,43.95 39.2,48 36.51,50.69 35.69,50.69 v35.64,50.73 | U$2.24 7.67,48.9 8.03,48.9 8.39,48.54 v14.91,48.54
  Bottom 0.102: v35.64,50.73 33.46,48.54 v14.91,48.54
N$90  (via drill 0.35)
  Top 0.102: J1.38 32.87,43.57 32.87,43.18 34.1,41.95 36.91,41.95 38.87,43.91 38.87,47.58 v36.29,50.16 | U$2.25 7.67,48.4 8.03,48.4 8.42,48.01 v15.6,48.01
  Bottom 0.102: v36.29,50.16 36.24,50.12 35.42,50.12 33.45,48.14 15.72,48.14 v15.6,48.01
N$91  (via drill 0.35)
  Top 0.102: J1.37 33.27,43.57 33.27,43.18 34.3,42.15 36.83,42.15 38.54,43.87 38.54,47.39 36.44,49.48 35.75,49.48 v35.64,49.59 | U$2.26 7.67,47.9 8.03,47.9 8.52,47.41 v14.93,47.41
  Bottom 0.102: v35.64,49.59 33.81,47.76 16.16,47.76 15.82,47.41 v14.93,47.41
N$92  (via drill 0.35)
  Top 0.102: J1.36 33.67,43.57 33.67,43.18 34.49,42.36 36.74,42.36 38.23,43.84 38.23,46.94 v36.22,48.95 | U$2.27 7.67,47.4 8.03,47.4 8.56,46.87 v15.6,46.87
  Bottom 0.102: v36.22,48.95 36.12,48.85 35.42,48.85 34.08,47.51 16.23,47.51 v15.6,46.87
N$93  (via drill 0.35)
  Top 0.102: J1.35 34.06,43.19 34.69,42.56 36.66,42.56 37.93,43.83 37.93,46.73 36.44,48.21 35.75,48.21 v35.64,48.32 | U$2.28 7.67,46.9 8.03,46.9 8.64,46.29 v14.95,46.29
  Bottom 0.102: v35.64,48.32 34.58,47.25 16.8,47.25 15.84,46.29 v14.95,46.29
N$94  (via drill 0.35)
  Top 0.102: J1.34 34.47,43.57 34.47,43.18 34.89,42.76 36.58,42.76 37.6,43.78 37.6,46.31 v36.22,47.68 | U$2.29 7.67,46.4 8.03,46.4 8.67,45.76 v15.63,45.76
  Bottom 0.102: v36.22,47.68 36.12,47.58 35.42,47.58 34.84,47 16.87,47 v15.63,45.76
N$95  (via drill 0.35)
  Top 0.102: J1.33 34.87,43.57 34.87,43.18 35.09,42.97 36.49,42.97 37.27,43.74 37.27,46.02 36.39,46.89 35.8,46.89 v35.64,47.05 | U$2.30 7.67,45.9 8.03,45.9 8.79,45.14 v15.04,45.14
  Bottom 0.102: v35.64,47.05 35.26,46.67 17.33,46.67 15.8,45.14 v15.04,45.14
N$96  (via drill 0.35)
  Top 0.102: J1.32 35.4,43.44 36.68,43.44 36.93,43.7 36.93,45.85 36.42,46.36 v36.17,46.36 | v15.7,44.58 8.48,44.58 U$2.31
  Bottom 0.102: v36.17,46.36 17.48,46.36 v15.7,44.58
N$97
  Top 0.102: U$4.31 36.87,13.5 36.87,13.75 35.26,15.36 J2.32
N$98
  Top 0.102: U$4.30 36.24,13.51 36.24,13.88 34.86,15.26 J2.33
N$99
  Top 0.102: U$4.29 35.87,13.5 35.87,13.75 34.46,15.16 J2.34
N$100
  Top 0.102: U$4.28 35.37,13.5 35.37,13.75 34.06,15.06 J2.35
N$101
  Top 0.102: U$4.27 34.87,13.5 34.87,13.75 33.66,14.96 J2.36
N$102
  Top 0.102: U$4.26 34.37,13.5 34.37,13.75 33.26,14.86 J2.37
N$103
  Top 0.102: U$4.25 33.87,13.5 33.87,13.75 32.86,14.76 J2.38
N$104
  Top 0.102: U$4.24 33.31,13.81 32.46,14.66 J2.39
N$105
  Top 0.102: U$4.23 32.81,13.81 32.06,14.56 J2.40
N$106
  Top 0.102: U$4.22 32.37,13.5 32.37,13.75 31.66,14.46 J2.41
N$107
  Top 0.102: U$4.21 31.86,13.5 31.86,13.75 31.26,14.36 J2.42
N$108
  Top 0.102: U$4.20 31.24,13.51 31.24,13.88 30.86,14.26 J2.43
N$109
  Top 0.102: J2.44 30.46,34.09 30.61,33.94 30.61,13.64 U$4.19
N$110
  Top 0.102: J2.45 30.06,34.2 30.31,33.95 U$4.18 30.31,13.45 U$4.18
N$111
  Top 0.102: J2.46 29.66,34.33 29.79,34.2 29.79,13.72 29.81,13.7 U$4.17
N$112
  Top 0.102: J2.47 29.26,13.49 U$4.16
N$113
  Top 0.102: J2.48 28.86,13.49 U$4.15
N$114
  Top 0.102: J2.49 28.46,34.33 28.33,34.2 28.33,13.47 U$4.14
N$115
  Top 0.102: J2.50 28.06,14.57 27.75,14.26 27.75,13.5 U$4.13
N$116
  Top 0.102: U$4.12 27.25,13.5 27.25,14.26 27.66,14.67 J2.51
N$117
  Top 0.102: U$4.11 26.75,13.5 26.75,14.26 27.26,14.77 J2.52
N$118
  Top 0.102: U$4.10 26.25,13.5 26.25,14.39 26.86,14.99 J2.53
N$119
  Top 0.102: U$4.9 25.88,13.51 25.88,14.52 26.46,15.09 J2.54
N$120
  Top 0.102: U$4.8 25.25,13.5 25.25,14.52 25.8,15.07 25.8,33.31 26.06,33.57 J2.55
N$121
  Top 0.102: U$4.7 24.88,13.51 24.88,14.64 25.28,15.04 25.28,33.31 25.66,33.7 J2.56
N$122
  Top 0.102: U$4.6 24.38,13.51 24.38,14.77 24.88,15.27 24.88,33.44 25.26,33.82 J2.57
N$123
  Top 0.102: U$4.5 23.88,13.51 23.88,15.02 24.22,15.37 24.22,33.44 24.86,34.08 J2.58
N$124
  Top 0.102: U$4.4 23.25,13.5 23.25,14.9 23.7,15.34 23.7,33.31 24.46,34.08 J2.59
N$125
  Top 0.102: U$4.3 22.81,15.08 23.17,15.44 23.17,33.31 24.06,34.2 J2.60
N$126
  Top 0.102: U$4.2 22.25,13.5 22.25,15.15 22.64,15.54 22.64,33.31 23.66,34.33 J2.61
N$127
  Top 0.102: U$4.1 21.81,15.21 22.24,15.64 22.24,33.44 23.26,34.46 J2.62
N$128
  Top 0.102: U$4.0 21.31,15.48 21.76,15.93 21.76,33.61 J2.63

### Text on the board
tPlace: 0 | 31 | 63 | 32 | 64 | 95 | 127 | 96
bPlace: 0 | 31 | James Wong, Carnegie Mellon University / Intan 128 Pin to FCB Headstage v3 / 6/1/2021 | 63 | 0 | 31 | 63 | 32 | 32 | 95 | 64 | 95 | 96 | 127 | 64 | 127 | 96